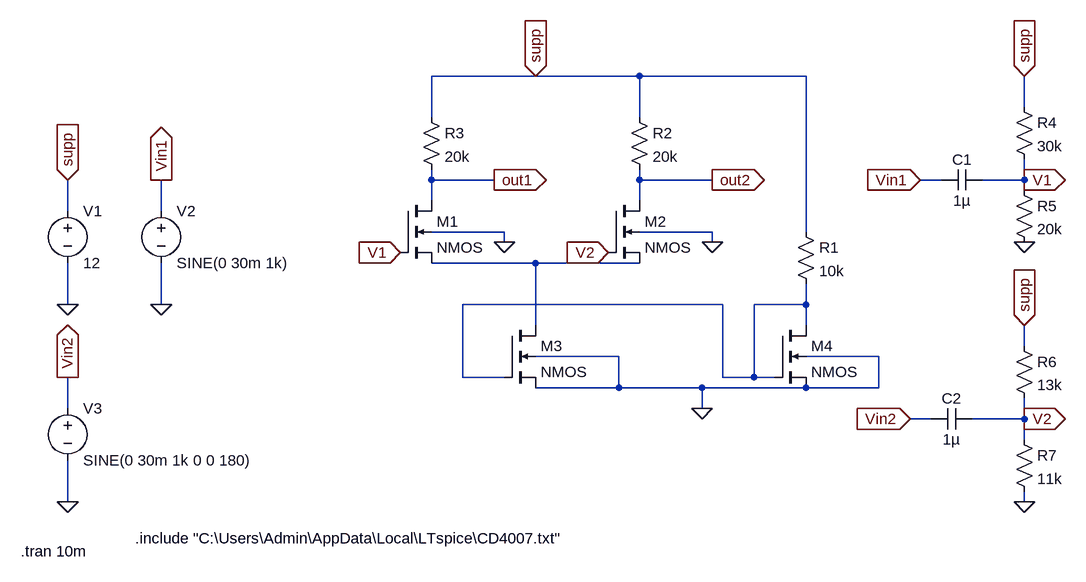
[diagram p0: schematic EW2_project1_amp_stage_2.asc]
EW2_project1_amp_stage_2.asc, the LTspice schematic file:
Version 4
SHEET 1 988 828
WIRE 64 80 -96 80
WIRE 224 80 64 80
WIRE 480 80 224 80
WIRE 816 128 816 80
WIRE -96 144 -96 80
WIRE 224 144 224 80
WIRE -96 240 -96 224
WIRE 0 240 -96 240
WIRE 224 240 224 224
WIRE 336 240 224 240
WIRE 688 240 656 240
WIRE 816 240 816 208
WIRE 816 240 752 240
WIRE 816 256 816 240
WIRE -96 272 -96 240
WIRE 224 272 224 240
WIRE -656 288 -656 240
WIRE -512 288 -512 240
WIRE 16 320 -96 320
WIRE 336 320 224 320
WIRE 480 320 480 80
WIRE 16 336 16 320
WIRE 336 336 336 320
WIRE 64 368 -96 368
WIRE 224 368 64 368
WIRE -656 432 -656 368
WIRE -512 432 -512 368
WIRE 352 432 -48 432
WIRE 480 432 480 400
WIRE 480 432 400 432
WIRE 64 464 64 368
WIRE 480 464 480 432
WIRE 816 496 816 464
WIRE 192 512 64 512
WIRE 592 512 480 512
WIRE -48 544 -48 432
WIRE 16 544 -48 544
WIRE 352 544 352 432
WIRE 400 544 400 432
WIRE 400 544 352 544
WIRE 432 544 400 544
WIRE 192 560 192 512
WIRE 192 560 64 560
WIRE 320 560 192 560
WIRE 480 560 320 560
WIRE 592 560 592 512
WIRE 592 560 480 560
WIRE -656 592 -656 544
WIRE 320 592 320 560
WIRE 672 608 640 608
WIRE 816 608 816 576
WIRE 816 608 736 608
WIRE 816 640 816 608
WIRE -656 736 -656 672
WIRE 816 736 816 720
FLAG 336 336 0
FLAG 16 336 0
FLAG -656 240 supp
IOPIN -656 240 In
FLAG 64 80 supp
IOPIN 64 80 In
FLAG -512 432 0
FLAG -656 432 0
FLAG -656 736 0
FLAG 816 336 0
FLAG 816 80 supp
IOPIN 816 80 In
FLAG 656 240 Vin1
IOPIN 656 240 In
FLAG 640 608 Vin2
IOPIN 640 608 In
FLAG 816 464 supp
IOPIN 816 464 In
FLAG 816 736 0
FLAG 0 240 out1
IOPIN 0 240 Out
FLAG 336 240 out2
IOPIN 336 240 Out
FLAG -144 352 V1
IOPIN -144 352 In
FLAG 176 352 V2
IOPIN 176 352 In
FLAG 816 240 V1
IOPIN 816 240 Out
FLAG 816 608 V2
IOPIN 816 608 Out
FLAG -512 240 Vin1
IOPIN -512 240 Out
FLAG -656 544 Vin2
IOPIN -656 544 Out
FLAG 320 592 0
SYMBOL nmos4 -144 272 R0
SYMATTR InstName M1
SYMATTR Value2 l=10u w=30u
SYMBOL nmos4 176 272 R0
SYMATTR InstName M2
SYMATTR Value2 l=10u w=30u
SYMBOL nmos4 16 464 R0
SYMATTR InstName M3
SYMATTR Value2 l=10u w=30u
SYMBOL nmos4 432 464 R0
SYMATTR InstName M4
SYMATTR Value2 l=10u w=30u
SYMBOL res 464 304 R0
SYMATTR InstName R1
SYMATTR Value 10k
SYMBOL res 208 128 R0
SYMATTR InstName R2
SYMATTR Value 20k
SYMBOL res -112 128 R0
SYMATTR InstName R3
SYMATTR Value 20k
SYMBOL voltage -656 272 R0
WINDOW 123 0 0 Left 0
WINDOW 39 0 0 Left 0
SYMATTR InstName V1
SYMATTR Value 12
SYMBOL voltage -512 272 R0
WINDOW 123 0 0 Left 0
WINDOW 39 0 0 Left 0
SYMATTR InstName V2
SYMATTR Value SINE(0 30m 1k)
SYMBOL voltage -656 576 R0
WINDOW 123 0 0 Left 0
WINDOW 39 0 0 Left 0
SYMATTR InstName V3
SYMATTR Value SINE(0 30m 1k 0 0 180)
SYMBOL res 800 112 R0
SYMATTR InstName R4
SYMATTR Value 30k
SYMBOL res 800 240 R0
SYMATTR InstName R5
SYMATTR Value 20k
SYMBOL cap 752 224 R90
WINDOW 0 0 32 VBottom 2
WINDOW 3 32 32 VTop 2
SYMATTR InstName C1
SYMATTR Value 1µ
SYMBOL res 800 480 R0
SYMATTR InstName R6
SYMATTR Value 13k
SYMBOL res 800 624 R0
SYMATTR InstName R7
SYMATTR Value 11k
SYMBOL cap 736 592 R90
WINDOW 0 0 32 VBottom 2
WINDOW 3 32 32 VTop 2
SYMATTR InstName C2
SYMATTR Value 1µ
TEXT -552 792 Left 2 !.include "C:\\Users\\Admin\\AppData\\Local\\LTspice\\CD4007.txt"
TEXT -728 812 Left 2 !.tran 10m

The netlist it stands for:
* EW2_project1_amp_stage_2.asc
M1 out1 V1 N001 0 NMOS l=10u w=30u
M2 out2 V2 N001 0 NMOS l=10u w=30u
M3 N001 N002 0 0 NMOS l=10u w=30u
M4 N002 N002 0 0 NMOS l=10u w=30u
R1 supp N002 10k
R2 supp out2 20k
R3 supp out1 20k
V1 supp 0 12
V2 Vin1 0 SINE(0 30m 1k)
V3 Vin2 0 SINE(0 30m 1k 0 0 180)
R4 supp V1 30k
R5 V1 0 20k
C1 V1 Vin1 1µ
R6 supp V2 13k
R7 V2 0 11k
C2 V2 Vin2 1µ
.model NMOS NMOS
.model PMOS PMOS
.lib standard.mos
.include "C:\Users\Admin\AppData\Local\LTspice\CD4007.txt"
.tran 10m
.backanno
.end